# EAGLE design XenoGC (EAGLE 6.6.0)
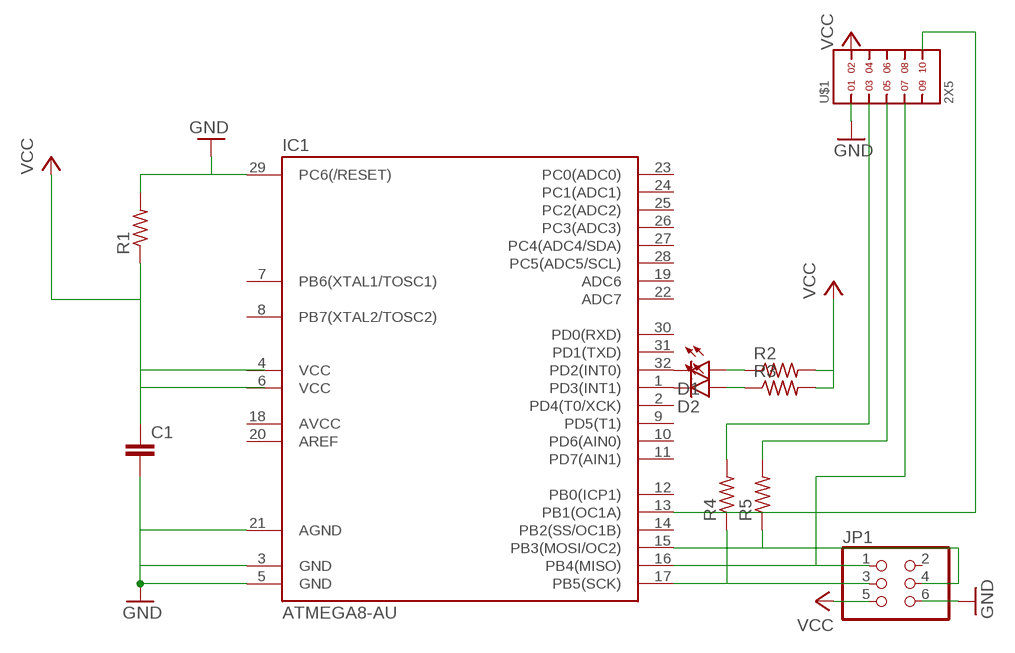
[diagram p0: schematic, sheet 1]

## Parts
C1  C-EUC1206  [C1206]
D1  PINK  LED-PINK1206  [LED-1206]
D2  PINK  LED-PINK1206  [LED-1206]
IC1  ATMEGA8-AU  [TQFP32-08]
JP1  PINHD-2X3  [2X03]
R1  R-US_R1206  [R1206]
R2  R-US_R1206  [R1206]
R3  R-US_R1206  [R1206]
R4  R-US_R1206  [R1206]
R5  R-US_R1206  [R1206]
U$1  2X5  [FTSH-105-01-XXX-DV-K]

## Nets
GND: C1.2 IC1.3(GND) IC1.5(GND) IC1.21(AGND) IC1.29(PC6(/RESET)) JP1.6 R1.2 U$1.1
N$1: D1.C IC1.32(PD2(INT0))
N$2: D2.C IC1.1(PD3(INT1))
N$3: D1.A R2.1
N$4: D2.A R3.1
N$7: IC1.17(PB5(SCK)) JP1.3 R4.1
N$8: IC1.16(PB4(MISO)) JP1.1 U$1.7
N$9: IC1.15(PB3(MOSI/OC2)) JP1.4 R5.1
N$10: R4.2 U$1.3
N$11: R5.2 U$1.5
N$13: IC1.13(PB1(OC1A)) U$1.10
VCC: C1.1 JP1.5 R1.1 R2.2 R3.2 U$1.2
Unconnected: IC1.2(PD4(T0/XCK)) IC1.7(PB6(XTAL1/TOSC1)) IC1.8(PB7(XTAL2/TOSC2)) IC1.9(PD5(T1)) IC1.10(PD6(AIN0)) IC1.11(PD7(AIN1)) IC1.12(PB0(ICP1)) IC1.14(PB2(SS/OC1B)) IC1.18(AVCC) IC1.19(ADC6) IC1.20(AREF) IC1.22(ADC7) IC1.23(PC0(ADC0)) IC1.24(PC1(ADC1)) IC1.25(PC2(ADC2)) IC1.26(PC3(ADC3)) IC1.27(PC4(ADC4/SDA)) IC1.28(PC5(ADC5/SCL)) IC1.30(PD0(RXD)) IC1.31(PD1(TXD)) JP1.2 U$1.4 U$1.6 U$1.8 U$1.9

## Power pins joined to a net without a drawn wire
VCC: IC1.4(VCC) IC1.6(VCC)

## Library data of the parts
C1 = resistor:C-EU: CAPACITOR, European symbol
D1 D2 = SparkFun-LED:LED-PINK: Various Pink LEDs Pink LEDs used in SFE Production LILYPAD- DIO-10415; PROD_ID: DIO-10415
IC1 = atmega8:ATMEGA8
JP1 = pinhead:PINHD-2X3: PIN HEADER
R1-R5 = resistor:R-US_: RESISTOR, American symbol
U$1 = pinheadsmd:2X5

## Board
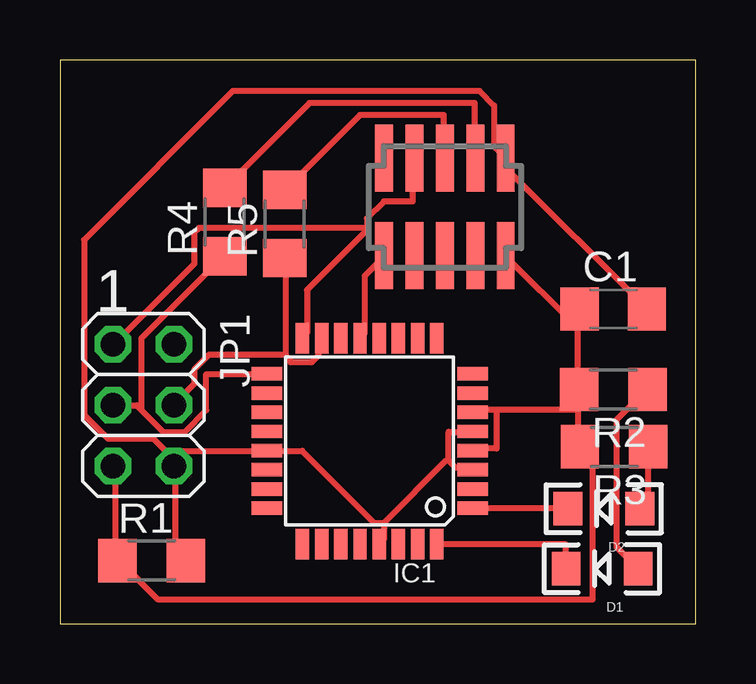
[diagram p1: board, top side]

Size 26.5 x 23.5 mm. Coordinates in mm from the lower left corner, seen from the top.
Outline: 0,0 26.5,0 26.5,23.5 0,23.5 0,0
Copper layers (1*16): Top 0.035mm / dielectric 1.5mm / Bottom 0.035mm
Design rules "default": minimum track width 10mil, minimum drill 24mil, track to track 8mil, track to pad 8mil, pad to pad 8mil, via to via 8mil, smd to smd 8mil, copper to edge 40mil, drill to drill 8mil, minimum pad ring 10mil, minimum via ring 8mil, stop-mask expansion 4mil, vias tented up to drill 0mil, thermal gap 10mil

### Footprints (pad centres in the part's own frame; a part is rotated, then mirrored left to right if it is on the bottom)
C1206 = smd 1.6 x 1.8: 1 -1.4,0; 2 1.4,0
LED-1206 = smd 1.2 x 1.4: A -1.5,0; C 1.5,0
TQFP32-08 = smd 1.27 x 0.559: 1 -4.293,2.8; 2 -4.293,2; 3 -4.293,1.2; 4 -4.293,0.4; 5 -4.293,-0.4; 6 -4.293,-1.2; 7 -4.293,-2; 8 -4.293,-2.8; 17 4.293,-2.8; 18 4.293,-2; 19 4.293,-1.2; 20 4.293,-0.4; 21 4.293,0.4; 22 4.293,1.2; 23 4.293,2; 24 4.293,2.8 | smd 0.559 x 1.27: 9 -2.8,-4.293; 10 -2,-4.293; 11 -1.2,-4.293; 12 -0.4,-4.293; 13 0.4,-4.293; 14 1.2,-4.293; 15 2,-4.293; 16 2.8,-4.293; 25 2.8,4.293; 26 2,4.293; 27 1.2,4.293; 28 0.4,4.293; 29 -0.4,4.293; 30 -1.2,4.293; 31 -2,4.293; 32 -2.8,4.293
2X03 = drill 1.016 octagon: 1 -2.54,-1.27; 2 -2.54,1.27; 3 0,-1.27; 4 0,1.27; 5 2.54,-1.27; 6 2.54,1.27
R1206 = smd 1.6 x 1.803: 1 -1.422,0; 2 1.422,0
FTSH-105-01-XXX-DV-K = smd 0.737 x 2.794: 1 -2.54,-2.032; 2 -2.54,2.032; 3 -1.27,-2.032; 4 -1.27,2.032; 5 0,-2.032; 6 0,2.032; 7 1.27,-2.032; 8 1.27,2.032; 9 2.54,-2.032; 10 2.54,2.032

### Placement (x,y rotation side)
C1  23.07,13.11 0 top
D1  22.6,2.29 180 top
D2  22.68,4.79 180 top
IC1  12.91,7.61 180 top
JP1  3.48,9.11 270 top
R1  3.82,2.63 0 top
R2  23.07,9.76 180 top
R3  23.1,7.37 180 top
R4  6.87,16.74 90 top
R5  9.37,16.66 90 top
U$1  16.05,17.37 180 top

### Tracks (layer width: path | path; a pad name or v marks a point on that pad's centre or on a via)
GND
  Top 0.254: C1.2 24.4,13.2 18.6,19 U$1.1 18.5,19.5 18.1,19.9 18.1,21.6 17.5,22.2 7.2,22.2 1,16 1,8.7 2,7.7 3.9,7.7 4.7,6.9 JP1.6 | 16.2,6.8 16.2,8 IC1.5 | 16.2,6.8 16.5,6.5 17.2,6.5 IC1.3 | 13.5,4.2 13.5,3.5 13.4,3.4 IC1.29 | 13.5,4.2 16.1,6.8 16.2,6.8 | JP1.6 4.8,6.6 4.8,7.2 8.6,7.2 IC1.21 8.7,7.2 10.1,7.2 13.1,4.2 13.5,4.2 | R1.2 5.2,2.7 4.8,3.1 4.8,6.5 JP1.6
N$1
  Top 0.254: D1.C 21.1,3.3 15.8,3.3 IC1.32
N$2
  Top 0.254: IC1.1 17.3,4.8 21.1,4.8 D2.C
N$3
  Top 0.254: D1.A 23.2,3.2 23.2,8.5 24.4,9.7 R2.1
N$4
  Top 0.254: D2.A 24.2,4.8 24.5,5.1 24.5,7.3 R3.1
N$7
  Top 0.254: 3.35,8.95 3.2,9.1 2.3,9.1 JP1.3 | 3.35,8.95 4.3,8 5.2,8 6.1,8.9 6.1,10.4 8.6,10.4 IC1.17 | R4.1 6.8,15.3 3.4,11.9 3.4,9 3.35,8.95
N$8
  Top 0.254: 12.8,16.5 12.8,16.9 13.5,17.6 14.7,17.6 14.7,19.4 U$1.7 | 12.8,16.5 12.8,16.4 10.3,13.9 10.3,12.1 10.2,12 IC1.16 | 12.8,16.5 5.8,16.5 5.6,16.3 5.6,15 2.3,11.7 JP1.1
N$9
  Top 0.254: 9.4,11.2 9.6,11 9.6,10.9 10.5,10.9 10.8,11.2 10.8,11.8 IC1.15 | 9.4,11.2 9.4,15.2 R5.1 | 9.4,11.2 6.2,11.2 5.6,10.6 5.6,10 4.8,9.2 JP1.4
N$10
  Top 0.254: R4.2 6.9,18.2 10.4,21.7 17.3,21.7 17.3,19.5 U$1.3
N$11
  Top 0.254: R5.2 9.4,18.1 12.5,21.2 16,21.2 16,19.5 U$1.5
N$13
  Top 0.254: IC1.13 12.6,12 12.7,12.1 12.7,14.5 13.5,15.3 U$1.10
VCC
  Top 0.254: JP1.5 2.3,6.5 2.3,2.7 R1.1 2.5,2.6 4.1,1 22.2,1 22.2,6.8 21.7,7.3 R3.2 21.6,7.4 21.6,8.9 | 21.6,8.9 18.2,8.9 | 18.2,8.9 17.3,8.9 IC1.6 | 21.6,8.9 21.6,9.7 R2.2 21.6,9.8 21.6,13.1 C1.1 21.5,12.4 18.6,15.3 U$1.2 | 18.2,8.9 18.2,7.3 17.3,7.3 IC1.4

### Text on the board
tNames: 1